# EAGLE design Controller Board (EAGLE 7.6.0)
Welcome Mat Control Board
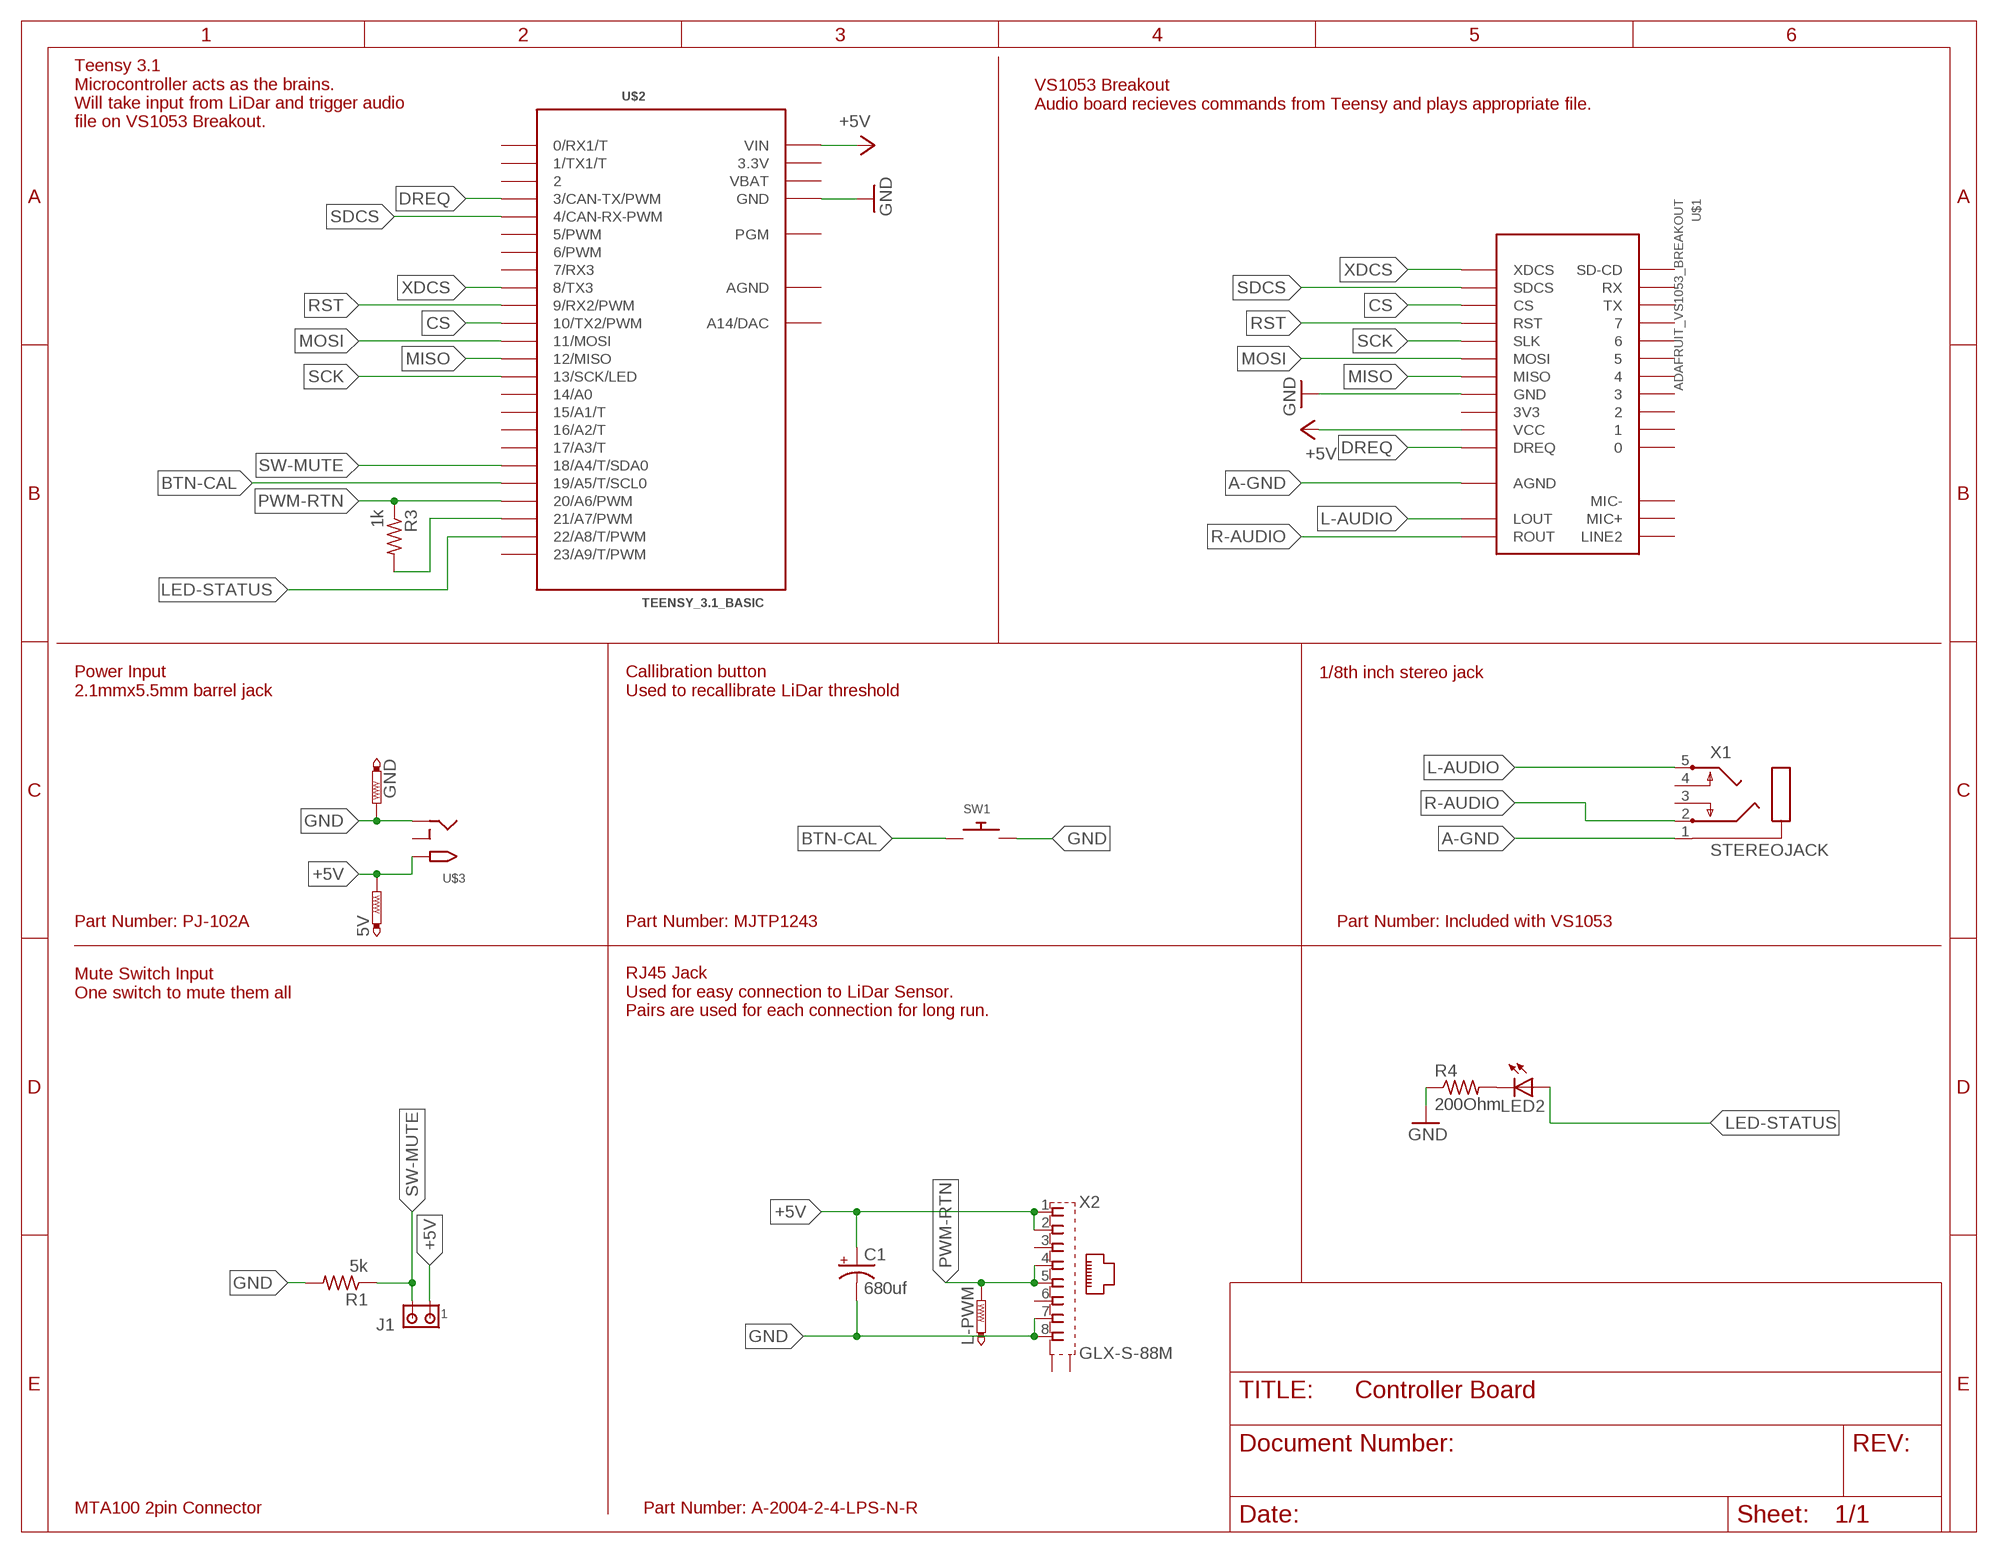
[diagram p0: schematic, sheet 1]

## Parts
5V  PTR1PAD1-13  [P1-13]
C1  680uf  CPOL-USE5-10.5  [E5-10,5]
GND  PTR1PAD1-13  [P1-13]
J1  MTA02-100  [10X02MTA]
L-PWM  PTR1PAD1-13  [P1-13]
LED2  LED3MM  [LED3MM]
R1  5k  R-US_0204/7  [0204/7]
R3  1k  R-US_0204/5  [0204/5]
R4  200Ohm  R-US_0204/7  [0204/7]
SW1  SWITCH_PUSHBUTTONEVQ-PE  [TACT_PANA-EVQ]
U$1  ADAFRUIT_VS1053_BREAKOUT  [ADAFRUIT_VS1053_BREAKOUT]
U$2  TEENSY_3.1_BASIC  [TEENSY_3.1_BASIC]
U$3  2.1MMJACKTHM  [PJ-102A]
X1  STEREOJACK  [STX3100]
X2  GLX-S-88M  [GLX-S-88M]

## Nets
+5V: 5V.TP C1.+ J1.1 U$1.P$10(VCC) U$2.VIN U$3.TIP X2.1 X2.2
A-GND: U$1.P$13(AGND) U$1.P$14(AGND) U$1.P$20(AGND) X1.1
BTN-CAL: SW1.P$1 U$2.19/A5(19/A5/T/SCL0)
CS: U$1.P$3(CS) U$2.10(10/TX2/PWM)
DREQ: U$1.P$11(DREQ) U$2.3(3/CAN-TX/PWM)
GND: C1.- GND.TP R1.2 R4.1 SW1.P$2 U$1.P$8(GND) U$1.P$12(GND) U$2.GND U$2.GND1(GND) U$3.RING X2.7 X2.8
L-AUDIO: U$1.P$15(LOUT) X1.5
LED-STATUS: LED2.A U$2.22/A8(22/A8/T/PWM)
MISO: U$1.P$7(MISO) U$2.12(12/MISO)
MOSI: U$1.P$6(MOSI) U$2.11(11/MOSI)
N$3: R3.2 U$2.21/A7(21/A7/PWM)
N$4: LED2.K(C) R4.2
PWM-RTN: L-PWM.TP R3.1 U$2.20/A6(20/A6/PWM) X2.4 X2.5
R-AUDIO: U$1.P$16(ROUT) X1.2
RST: U$1.P$4(RST) U$2.9(9/RX2/PWM)
SCK: U$1.P$5(SLK) U$2.13(13/SCK/LED)
SDCS: U$1.P$2(SDCS) U$2.4(4/CAN-RX-PWM)
SW-MUTE: J1.2 R1.1 U$2.18/A4(18/A4/T/SDA0)
XDCS: U$1.P$1(XDCS) U$2.8(8/TX3)
Unconnected: U$1.P$9(3V3) U$1.P$17(LINE2) U$1.P$18(MIC+) U$1.P$19(MIC-) U$1.P$21(3V3) U$1.P$22 U$1.P$23 U$1.P$24 U$1.P$25 U$1.P$26 U$1.P$27 U$1.P$28 U$1.P$29 U$1.P$30(TX) U$1.P$31(RX) U$1.P$32(SD-CD) U$2.0(0/RX1/T) U$2.1(1/TX1/T) U$2.2 U$2.5(5/PWM) U$2.6(6/PWM) U$2.7(7/RX3) U$2.14/A0 U$2.15/A1(15/A1/T) U$2.16/A2(16/A2/T) U$2.17/A3(17/A3/T) U$2.23/A9(23/A9/T/PWM) U$2.A14(A14/DAC) U$2.PGM U$3.RING_SW X1.3 X1.4 X2.3 X2.6 X2.S1 X2.S2

## Notes on the sheet
- VS1053 Breakout
  Audio board recieves commands from Teensy and plays appropriate file.
- Teensy 3.1
  Microcontroller acts as the brains.
  Will take input from LiDar and trigger audio
  file on VS1053 Breakout.
- 1/8th inch stereo jack
- Power Input
  2.1mmx5.5mm barrel jack
- Callibration button
  Used to recallibrate LiDar threshold
- Part Number: PJ-102A | Part Number: MJTP1243 | Part Number: Included with VS1053
- Mute Switch Input
  One switch to mute them all
- RJ45 Jack
  Used for easy connection to LiDar Sensor. 
  Pairs are used for each connection for long run.
- MTA100 2pin Connector | Part Number: A-2004-2-4-LPS-N-R

## Power pins joined to a net without a drawn wire
3.3V: U$2.3.3V U$2.3.3V1(3.3V)
AGND: U$2.AGND
VBAT: U$2.VBAT

## Library data of the parts
5V GND L-PWM = testpad:PTR1: TEST PIN
C1 = adafruit:CPOL-US: POLARIZED CAPACITOR, American symbol
J1 = mjs:MTA02-100: AMP connector Now with accurate tPlace.
LED2 = adafruit:LED: LED OSRAM: - CHIPLED LG R971, LG N971, LY N971, LG Q971, LY Q971, LO R971, LY R971 LH N974, LH R974 LS Q976, LO Q976, LY Q976 LO Q996 - Hyper CHIPLED LW Q18S LB Q993, LB Q99A, LB R99A - SideLED LS A670, LO A670, LY A670, LG A670, LP A670 LB A673, LV A673, LT A673, LW A673 LH A674 LY A675 LS A676, LA A676, LO A676, LY A676, LW A676 LS A679, LY A679, LG A679 - Hyper Micro SIDELED® LS Y876, LA Y876, LO Y876, LY Y876 LT Y87S - SmartLED LW L88C, LW L88S LB L89C, LB L89S, LG L890 LS L89K, LO L89K, LY L89K LS L896, LA L896, LO L896, LY L896 - TOPLED LS T670, LO T670, LY T670, LG T670, LP T670 LSG T670, LSP T670, LSY T670, LOP T670, LYG T670 LG T671, LOG T671, LSG T671 LB T673, LV T673, LT T673, LW T673 LH T674 LS T676, LA T676, LO T676, LY T676, LB T676, LH T676, LSB T676, LW T676 LB T67C, LV T67C, LT T67C, LS T67K, LO T67K, LY T67K, LW E67C LS E67B, LA E67B, LO E67B, LY E67B, LB E67C, LV E67C, LT E67C LW T67C LS T679, LY T679, LG T679 LS T770, LO T770, LY T770, LG T770, LP T770 LB T773, LV T773, LT T773, LW T773 LH T774 LS E675, LA E675, LY E675, LS T675 LS T776, LA T776, LO T776, LY T776, LB T776 LHGB T686 LT T68C, LB T68C - Hyper Mini TOPLED® LB M676 - Mini TOPLED Santana® LG M470 LS M47K, LO M47K, LY M47K Source: http://www.osram.convergy.de/
R1 R3 R4 = adafruit:R-US_: RESISTOR, American symbol
SW1 = adafruit:SWITCH_PUSHBUTTON: Buttons SOFTTOUCHSMD_SJ - Soft touch temporary push button (Super Junk Akihabara) Compatible with SKPMANE010 [Mouser: 688-SKPMAN] C&K_KSS = Digikey: KSS221GLFS
U$1 = mjs:ADAFRUIT_VS1053_BREAKOUT: Adafruit VS1053 Breakout MP3/AAC/Ogg/WAV/MIDI - MicroSD Card socket Part Number 1381 CAUTON: Mounting hole to pin spacing is -approximate-!
U$2 = mjs:TEENSY_3.1_BASIC: Footprint for Teensy 3.1 board using all pin connections on the outer perimeter
U$3 = adafruit:2.1MMJACK: 2.1mm x 5.5mm THM DC jack with internal switch. Digikey part #PJ-102A, 4UCON part #05537 2.1mm x 5.5mm SMT DC jack with internal switch. Digikey part #PJ-002A-SMT, 4UCON part #03267 By microbuilder.eu & adafruit.com
X1 = adafruit:STEREOJACK: MIC/HEADPHONE JACK Stereo jack with two switches. Kycon STX3100, CUI SJ1-3555NG and/or 4UCon 05544
X2 = con-kycon:GLX-S-88M: Mod. Jack, Right Angle, 8 posiotion, 8 contatcs RJ45 Source: GLX-S-88M.pdf; OC_FARNELL: unknown; OC_NEWARK: unknown

## Board
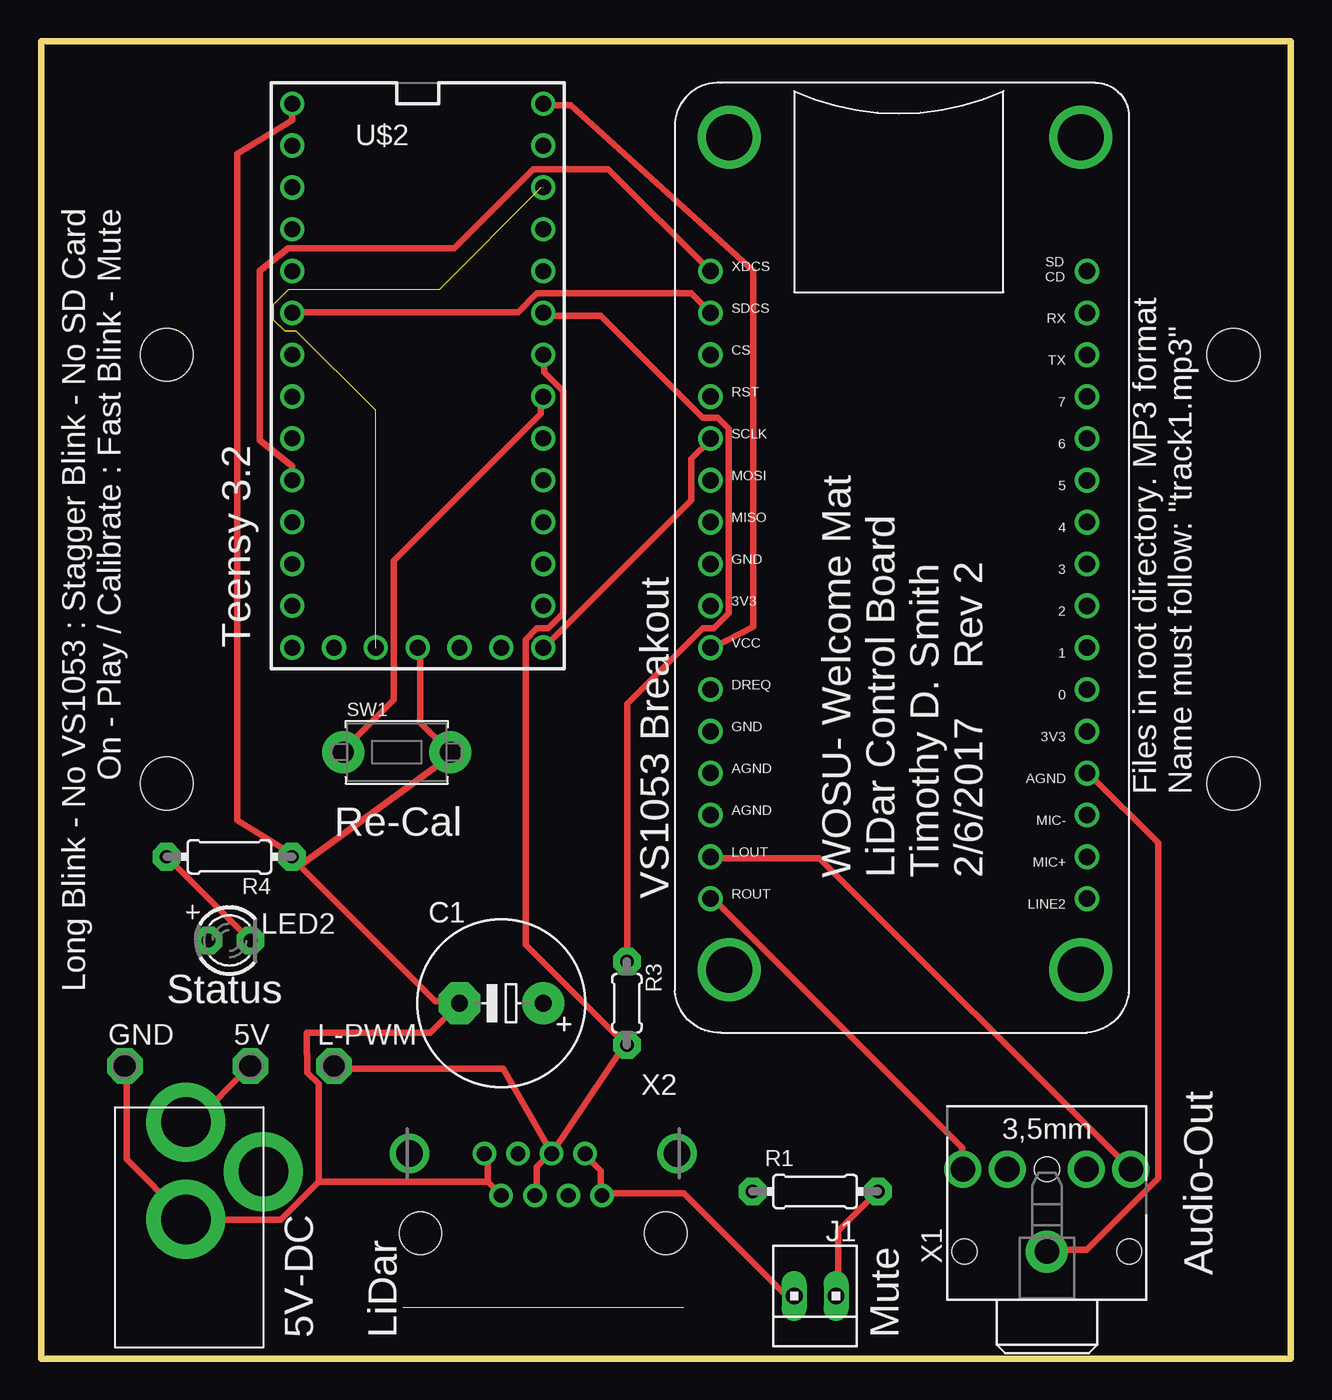
[diagram p1: board, top side]
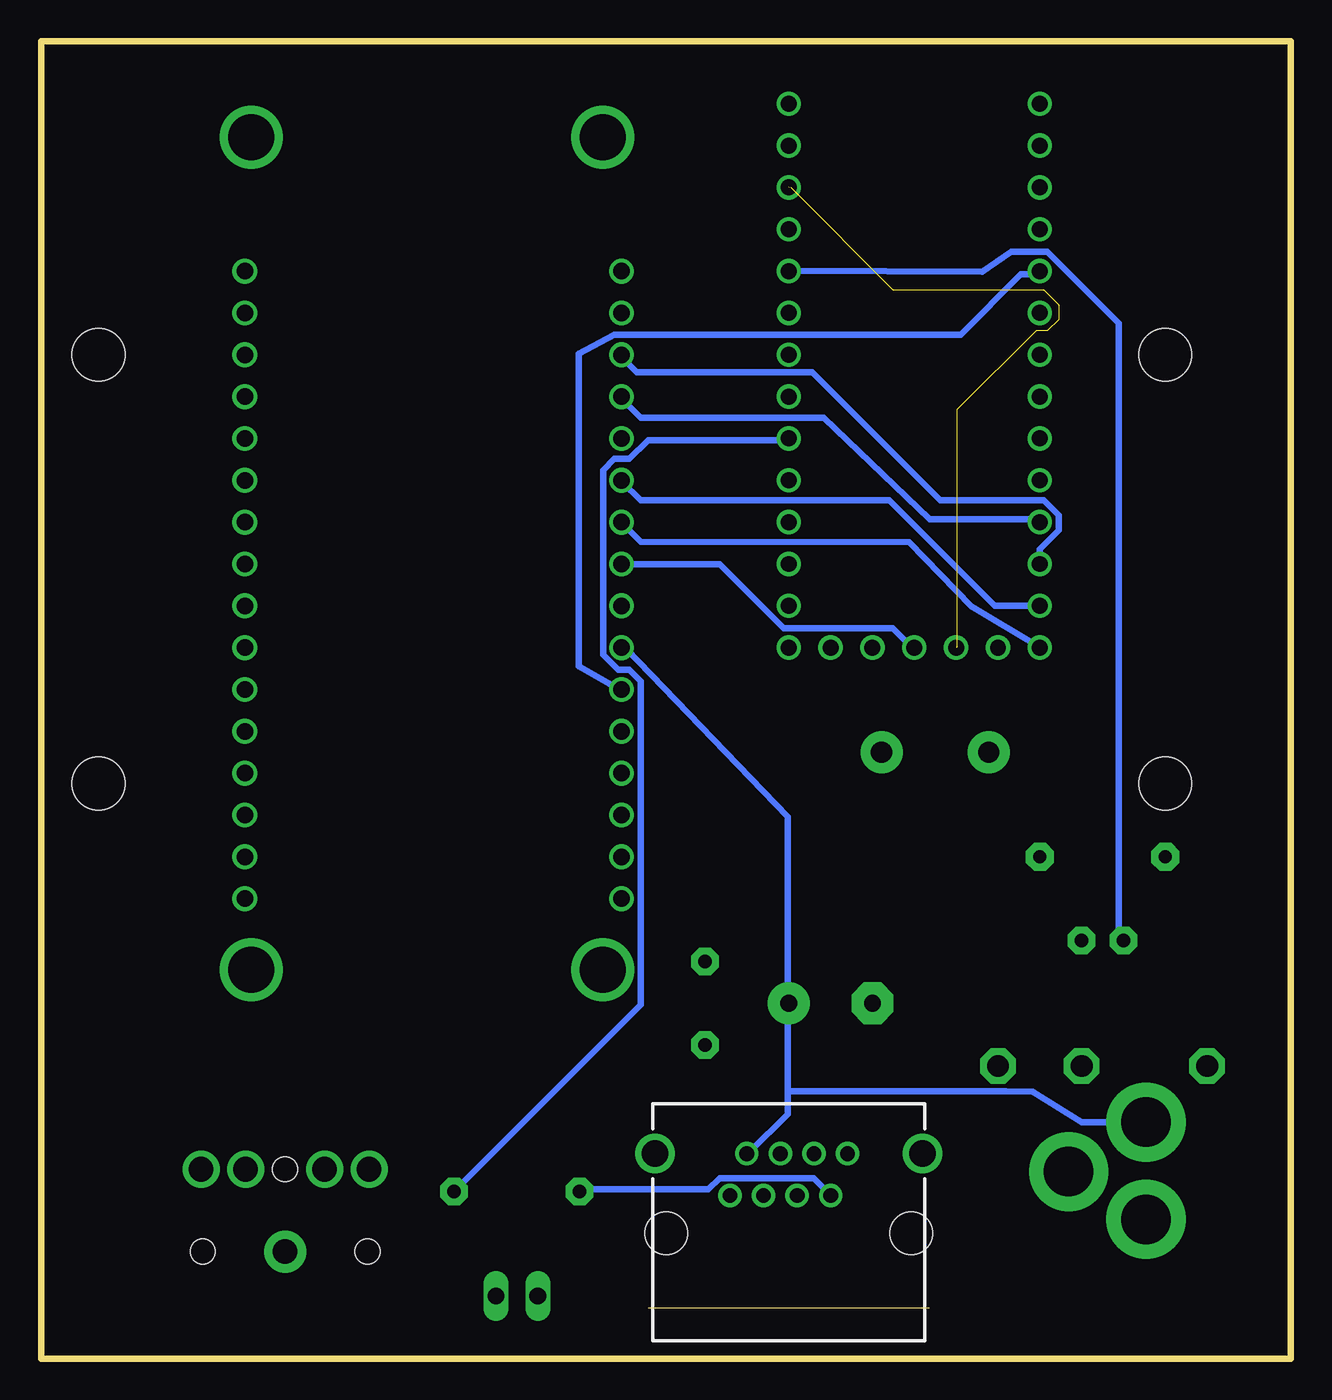
[diagram p2: board, bottom side, seen from below]

Size 75.87 x 80 mm. Coordinates in mm from the lower left corner, seen from the top.
Outline: 0,0 75.87,0 75.87,80 0,80 0,0
Copper layers (1*16): Top 0.035mm / dielectric 1.5mm / Bottom 0.035mm
Design rules "default": minimum track width 10mil, minimum drill 24mil, track to track 8mil, track to pad 8mil, pad to pad 8mil, via to via 8mil, smd to smd 8mil, copper to edge 40mil, drill to drill 8mil, minimum pad ring 10mil, minimum via ring 8mil, stop-mask expansion 4mil, vias tented up to drill 0mil, thermal gap 10mil
Holes 3.2 mm at 7.62,34.92 7.62,60.96 72.39,60.96 72.39,34.92

### Footprints (pad centres in the part's own frame; a part is rotated, then mirrored left to right if it is on the bottom)
P1-13 = drill 1.321 pad 2.159 octagon: TP 0,0
E5-10,5 = drill 1.016 pad 2.54: + -2.54,0 | drill 1.016 pad 2.54 octagon: - 2.54,0
10X02MTA = drill 1.016 long: 1 1.27,0; 2 -1.27,0
LED3MM = drill 0.813 pad 1.676 octagon: A -1.27,0; K 1.27,0
0204/7 = drill 0.813 pad 1.676 octagon: 1 -3.81,0; 2 3.81,0
0204/5 = drill 0.813 pad 1.676 octagon: 1 -2.54,0; 2 2.54,0
TACT_PANA-EVQ = drill 1.3 pad 2.54: P$1 -3.25,0; P$2 3.25,0
ADAFRUIT_VS1053_BREAKOUT = drill 1: P$1 -17.78,-11.43; P$2 -15.24,-11.43; P$3 -12.7,-11.43; P$4 -10.16,-11.43; P$5 -7.62,-11.43; P$6 -5.08,-11.43; P$7 -2.54,-11.43; P$8 0,-11.43; P$9 2.54,-11.43; P$10 5.08,-11.43; P$11 7.62,-11.43; P$12 10.16,-11.43; P$13 12.7,-11.43; P$14 15.24,-11.43; P$15 17.78,-11.43; P$16 20.32,-11.43; P$17 20.32,11.43; P$18 17.78,11.43; P$19 15.24,11.43; P$20 12.7,11.43; P$21 10.16,11.43; P$22 7.62,11.43; P$23 5.08,11.43; P$24 2.54,11.43; P$25 0,11.43; P$26 -2.54,11.43; P$27 -5.08,11.43; P$28 -7.62,11.43; P$29 -10.16,11.43; P$30 -12.7,11.43; P$31 -15.24,11.43; P$32 -17.78,11.43 | drill 2.8: P$33 -25.908,11.049; P$34 24.638,11.049; P$35 24.638,-10.287; P$36 -25.908,-10.287
TEENSY_3.1_BASIC = drill 0.965: 0 -7.62,13.97; 1 -7.62,11.43; 2 -7.62,8.89; 3 -7.62,6.35; 3.3V 7.62,11.43; 3.3V1 -2.54,-16.51; 4 -7.62,3.81; 5 -7.62,1.27; 6 -7.62,-1.27; 7 -7.62,-3.81; 8 -7.62,-6.35; 9 -7.62,-8.89; 10 -7.62,-11.43; 11 -7.62,-13.97; 12 -7.62,-16.51; 13 7.62,-16.51; 14/A0 7.62,-13.97; 15/A1 7.62,-11.43; 16/A2 7.62,-8.89; 17/A3 7.62,-6.35; 18/A4 7.62,-3.81; 19/A5 7.62,-1.27; 20/A6 7.62,1.27; 21/A7 7.62,3.81; 22/A8 7.62,6.35; 23/A9 7.62,8.89; A14 5.08,-16.51; AGND 7.62,13.97; GND -7.62,16.51; GND1 0,-16.51; PGM 2.54,-16.51; VBAT -5.08,-16.51; VIN 7.62,16.51
PJ-102A = drill 3 pad 4.8: RING 0.1,-3.39; RING_SW -4.6,-6.29; TIP 0.1,-9.29
STX3100 = drill 1.5 pad 2.54: 1 2.7,-0.1 | drill 1.5: 2 7.7,5; 3 7.7,2.3; 4 7.7,-2.5; 5 7.7,-5.2 | hole 1.5: 2.7,4.9; 2.7,-5.1; 7.7,-0.1
GLX-S-88M = drill 0.9 pad 1.422: 1 -3.57,-2.3; 2 -2.55,-4.84; 3 -1.53,-2.3; 4 -0.51,-4.84; 5 0.51,-2.3; 6 1.53,-4.84; 7 2.55,-2.3; 8 3.57,-4.84 | drill 1.6 pad 2.184: S1 -8.125,-4.84; S2 8.125,-4.84 | hole 2.55: -7.44,0; 7.44,0

### Placement (x,y rotation side)
5V  12.7,17.78 0 top
C1  27.94,21.59 180 top
GND  5.08,17.78 0 top
J1  46.99,3.81 180 top
L-PWM  17.78,17.78 0 top
LED2  11.43,25.4 0 top
R1  46.99,10.16 180 top
R3  35.56,21.59 90 top
R4  11.43,30.48 180 top
SW1  21.59,36.83 0 top
U$1  52.07,48.26 270 top
U$2  22.86,59.69 0 top
U$3  8.89,5.08 180 top
X1  60.96,3.81 90 top
X2  30.48,7.62 180 top

### Tracks (layer width: path | path; a pad name or v marks a point on that pad's centre or on a via)
3.3V  (10 unrouted)
+5V
  Top 0.406: U$2.VIN 30.56,76.12 32.16,76.12 43.23,66.06 43.23,44.45 40.84,43.2 U$1.P$10 | X2.2 33.07,12.34 33.98,11.43 33.98,10.06 X2.1 34.21,10.06 39.01,10.06 45.19,3.89 45.64,3.89 J1.1 | U$3.TIP 9.29,14.37 5V.TP
  Bottom 0.406: 30.56,16.23 30.56,14.86 32.84,12.57 X2.2 | 30.56,16.23 30.56,21.49 C1.+ 30.56,21.72 30.56,32.92 40.36,43.1 U$1.P$10 | 30.56,16.23 17.3,16.23 15.67,16.2 12.69,14.37 U$3.TIP
A-GND
  Top 0.406: X1.1 61.19,6.63 63.48,6.63 67.82,10.97 67.82,31.32 63.7,35.43 U$1.P$20
BTN-CAL
  Top 0.406: U$2.19/A5 30.33,58.29 30.33,57.38 21.41,48.46 21.41,40.01 18.44,37.03 SW1.P$1
CS
  Bottom 0.406: U$2.10 15.24,49.15 14.1,50.29 14.1,51.21 15.01,52.12 21.29,52.12 29.06,59.89 39.7,59.89 40.62,60.81 U$1.P$3
DREQ
  Bottom 0.406: U$2.3 15.24,65.84 16.38,65.84 20.04,62.18 41.07,62.18 43.23,61.04 43.23,42.06 40.84,40.69 U$1.P$11
GND
  Top 0.406: 27.13,10.74 27.13,12.34 X2.8 | 27.13,10.74 27.81,10.06 X2.7 | GND.TP 5.18,17.6 5.18,12.12 8.61,8.69 U$3.RING 8.84,8.46 14.55,8.46 16.84,10.74 | 16.84,10.74 27.13,10.74 | 24.61,37.03 24.97,36.68 15.7,29.95 | 24.61,37.03 23.01,38.63 23.01,42.98 U$2.GND1 | 24.61,37.03 SW1.P$2 | U$2.GND 15.24,75.21 11.91,73.15 11.91,32.69 15.24,30.63 R4.1 | 15.7,29.95 23.93,21.72 25.3,21.72 C1.- 23.62,19.81 16.13,19.81 16.13,18.52 16.15,18.52 16.15,17.37 16.84,16.69 16.84,10.74 | 15.24,30.4 R4.1 | 15.7,29.95 R4.1
  Bottom 0.406: R1.2 43.13,10.29 35.36,10.29 34.67,10.97 28.96,10.97 28.04,10.06 X2.7 | U$1.P$8 40.62,48.23 34.67,48.23 30.79,44.35 24.15,44.35 23.01,43.2 U$2.GND1
L-AUDIO
  Top 0.406: U$1.P$15 40.84,30.4 47.24,30.4 65.99,11.66 X1.5
LED-STATUS
  Bottom 0.406: U$2.22/A8 30.33,66.06 18.72,66.02 16.97,67.21 14.78,67.21 10.44,62.87 10.44,25.83 10.21,25.6 LED2.A
MISO
  Bottom 0.406: U$2.12 15.24,43.2 19.41,45.7 23.16,49.58 39.47,49.61 40.62,50.75 U$1.P$7
MOSI
  Bottom 0.406: U$2.11 17.98,45.72 24.38,52.12 39.47,52.12 40.62,53.26 U$1.P$6
N$3
  Top 0.406: U$2.21/A7 30.56,63.32 33.98,63.32 40.16,57.15 41.07,57.15 41.76,56.46 41.76,45.26 40.84,44.35 40.16,44.35 35.59,39.78 35.59,24.23 R3.2
N$4
  Top 0.406: R4.2 LED2.K
PWM-RTN
  Top 0.406: X2.5 30.1,10.06 30.1,11.66 30.79,12.34 X2.4 31.01,12.57 31.01,12.47 | U$2.20/A6 30.56,60.81 30.56,59.89 31.7,58.75 31.7,45.26 30.79,44.35 30.1,44.35 29.41,43.66 29.41,25.15 35.36,19.2 R3.1 35.36,18.97 31.01,12.47 | 31.01,12.47 28.04,17.6 17.98,17.6 L-PWM.TP
R-AUDIO
  Top 0.406: U$1.P$16 40.84,27.89 55.93,12.8 55.93,11.66 X1.2
RST
  Bottom 0.406: U$2.9 15.24,50.98 21.92,50.98 28.35,57.15 39.47,57.15 40.62,58.29 U$1.P$4
SCK
  Top 0.406: U$2.13 30.56,43.2 39.47,52.12 39.47,54.63 40.62,55.78 U$1.P$5
SDCS
  Top 0.406: U$2.4 15.24,63.55 28.96,63.55 30.1,64.69 39.47,64.69 40.62,63.55 U$1.P$2
SW-MUTE
  Top 0.406: J1.2 48.39,3.89 48.39,7.77 50.67,10.06 R1.1
  Bottom 0.406: R1.1 39.47,21.49 39.47,41.15 40.16,41.83 40.84,41.83 41.76,42.75 41.76,53.95 41.07,54.63 40.16,54.63 39.01,55.78 30.56,55.78 U$2.18/A4
XDCS
  Top 0.406: U$2.8 15.24,54.18 13.26,55.78 13.26,66.06 15.01,67.44 25.07,67.44 29.87,72.24 34.44,72.24 U$1.P$1

### Text on the board
tPlace: Long Blink - No VS1053 : Stagger Blink - No SD Card / On - Play / Calibrate : Fast Blink - Mute | Teensy 3.2 | Rev 2 | Files in root directory. MP3 format / Name must follow: "track1.mp3" | Re-Cal | WOSU- Welcome Mat / LiDar Control Board / Timothy D. Smith / 2/6/2017 | VS1053 Breakout | Status | Audio-Out | 5V-DC | LiDar | Mute